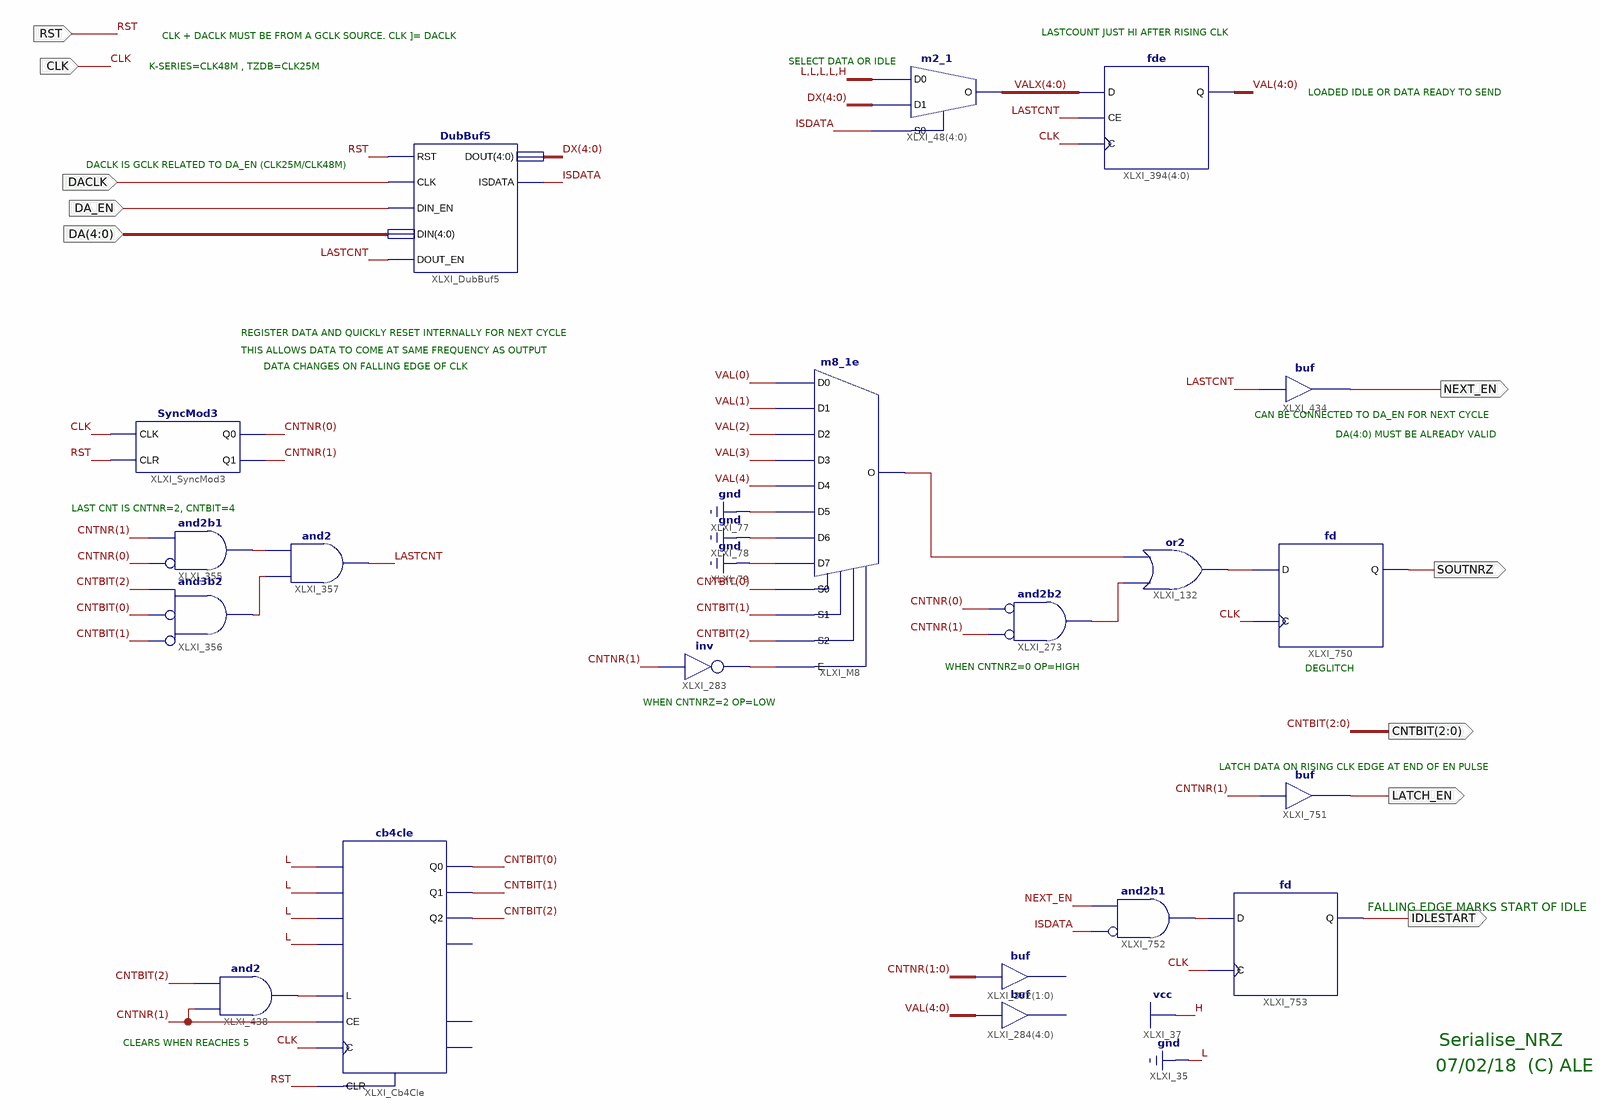
[diagram p0: schematic sheet 1]
// Xilinx ISE schematic Serialise_NRZ.sch (zynq) as structural Verilog: 20 symbols, 10 ports
module Serialise_NRZ (
  input  RST,
  input  CLK,
  input  DACLK,
  input  [4:0] DA,
  input  DA_EN,
  output SOUTNRZ,
  output NEXT_EN,
  output [2:0] CNTBIT,
  output IDLESTART,
  output LATCH_EN
);

  wire ISDATA, LASTCNT, XLXN_190, XLXN_303, XLXN_673, XLXN_712, XLXN_939, XLXN_940, XLXN_966, XLXN_976;
  wire [1:0] CNTNR;
  wire [4:0] DX, VAL, VALX;

  // buf XLXI_284[4..0] has open pins: I=VAL, O=open
  // buf XLXI_352[1..0] has open pins: I=CNTNR, O=open
  fde XLXI_394[4:0] (.C(CLK), .CE(LASTCNT), .D(VALX), .Q(VAL));
  m2_1 XLXI_48[4:0] (.D0(5'b00001), .D1(DX), .S0(ISDATA), .O(VALX));
  SyncMod3 XLXI_SyncMod3 (.CLK(CLK), .CLR(RST), .Q0(CNTNR[0]), .Q1(CNTNR[1]));
  and XLXI_355 (XLXN_939, ~CNTNR[0], CNTNR[1]);  // and2b1
  and XLXI_357 (LASTCNT, XLXN_940, XLXN_939);
  and XLXI_356 (XLXN_940, ~CNTBIT[1], ~CNTBIT[0], CNTBIT[2]);  // and3b2
  and XLXI_438 (XLXN_966, CNTNR[1], CNTBIT[2]);
  cb4cle XLXI_Cb4Cle (
    .C(CLK), .CE(CNTNR[1]), .CLR(RST), .D0(1'b0), .D1(1'b0), .D2(1'b0), .D3(1'b0), .L(XLXN_966),
    .Q0(CNTBIT[0]), .Q1(CNTBIT[1]), .Q2(CNTBIT[2]));  // open: CEO, Q3, TC
  m8_1e XLXI_M8 (
    .D0(VAL[0]), .D1(VAL[1]), .D2(VAL[2]), .D3(VAL[3]), .D4(VAL[4]), .D5(1'b0), .D6(1'b0), .D7(1'b0),
    .E(XLXN_190), .S0(CNTBIT[0]), .S1(CNTBIT[1]), .S2(CNTBIT[2]), .O(XLXN_712));
  not XLXI_283 (XLXN_190, CNTNR[1]);
  or XLXI_132 (XLXN_673, XLXN_303, XLXN_712);
  and XLXI_273 (XLXN_303, ~CNTNR[1], ~CNTNR[0]);  // and2b2
  buf XLXI_434 (NEXT_EN, LASTCNT);
  fd XLXI_750 (.C(CLK), .D(XLXN_673), .Q(SOUTNRZ));
  DubBuf5 XLXI_DubBuf5 (
    .CLK(DACLK), .DIN(DA), .DIN_EN(DA_EN), .DOUT(DX), .DOUT_EN(LASTCNT), .ISDATA(ISDATA), .RST(RST));
  fd XLXI_753 (.C(CLK), .D(XLXN_976), .Q(IDLESTART));
  buf XLXI_751 (LATCH_EN, CNTNR[1]);
  and XLXI_752 (XLXN_976, ~ISDATA, NEXT_EN);  // and2b1

  // Notes on the sheet:
  //   LASTCOUNT JUST HI AFTER RISING CLK
  //   CLK + DACLK MUST BE FROM A GCLK SOURCE. CLK ]= DACLK
  //   SELECT DATA OR IDLE
  //   K-SERIES=CLK48M , TZDB=CLK25M
  //   LOADED IDLE OR DATA READY TO SEND
  //   DACLK IS GCLK RELATED TO DA_EN (CLK25M/CLK48M)
  //   REGISTER DATA AND QUICKLY RESET INTERNALLY FOR NEXT CYCLE
  //   THIS ALLOWS DATA TO COME AT SAME FREQUENCY AS OUTPUT
  //   DATA CHANGES ON FALLING EDGE OF CLK
  //   CAN BE CONNECTED TO DA_EN FOR NEXT CYCLE
  //   DA(4:0) MUST BE ALREADY VALID
  //   LAST CNT IS CNTNR=2, CNTBIT=4
  //   WHEN CNTNRZ=0 OP=HIGH
  //   DEGLITCH
  //   WHEN CNTNRZ=2 OP=LOW
  //   LATCH DATA ON RISING CLK EDGE AT END OF EN PULSE
  //   FALLING EDGE MARKS START OF IDLE
  //   Serialise_NRZ
  //   CLEARS WHEN REACHES 5
  //   07/02/18  (C) ALE
endmodule
